# EAGLE design AS5040_forMotor (EAGLE 6.0)
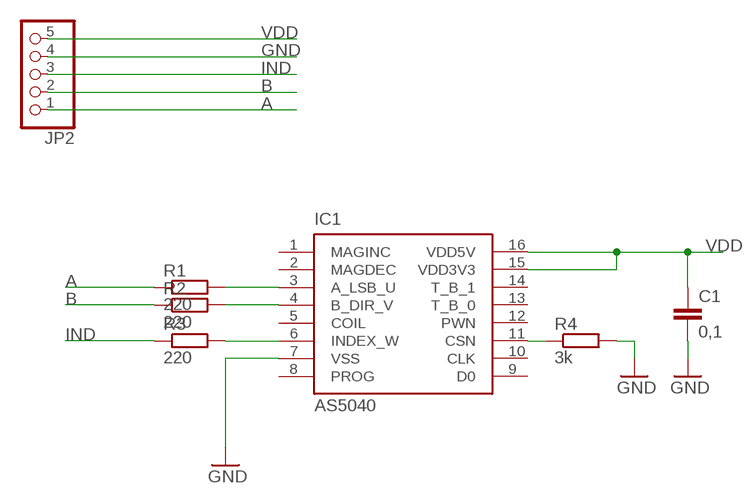
[diagram p0: schematic, sheet 1]

## Parts
C1  0,1  C-EUC0805  [C0805]
IC1  AS5040  [SSOP16]
JP2  PINHD-1X5  [1X05]
R1  220  R-EU_M0805  [M0805]
R2  220  R-EU_M0805  [M0805]
R3  220  R-EU_M0805  [M0805]
R4  3k  R-EU_M0805  [M0805]

## Nets
A: JP2.1 R1.1
B: JP2.2 R2.1
GND: C1.2 IC1.7(VSS) JP2.4 R4.2
IND: JP2.3 R3.1
N$1: IC1.6(INDEX_W) R3.2
N$2: IC1.3(A_LSB_U) R1.2
N$3: IC1.4(B_DIR_V) R2.2
N$4: IC1.11(CSN) R4.1
VDD: C1.1 IC1.15(VDD3V3) IC1.16(VDD5V) JP2.5
Unconnected: IC1.1(MAGINC) IC1.2(MAGDEC) IC1.5(COIL) IC1.8(PROG) IC1.9(D0) IC1.10(CLK) IC1.12(PWN) IC1.13(T_B_0) IC1.14(T_B_1)

## Library data of the parts
C1 = rcl:C-EU: CAPACITOR, European symbol
IC1 = austriamicrosystems:AS5040: 10-BIT PROGRAMMABLE MAGNETIC ROTARY ENCODER Source: www.austriamicrosystems.com .. AS5040DataSheetRev12.pdf; MPN: AS5040ASSU; OC_FARNELL: 1630800; OC_NEWARK: 59P4059
JP2 = pinhead:PINHD-1X5: PIN HEADER
R1-R4 = resistor:R-EU_: RESISTOR, European symbol

## Board
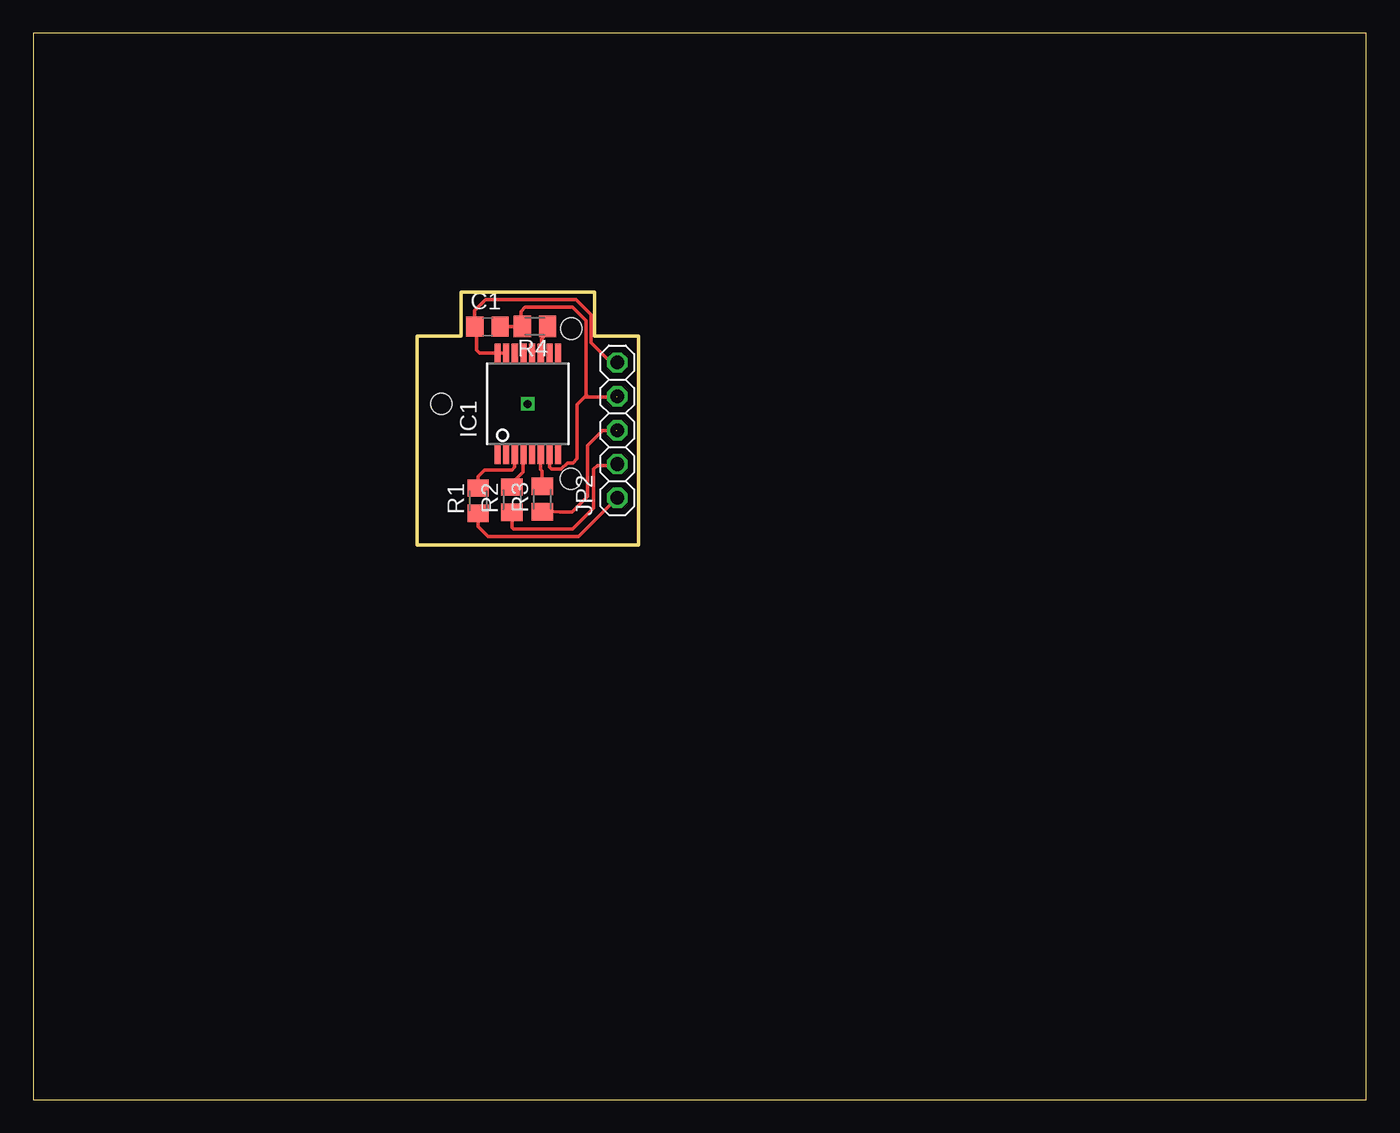
[diagram p1: board, top side]

Size 100 x 80 mm. Coordinates in mm from the lower left corner, seen from the top.
Outline: 0,0 100,0 100,80 0,80 0,0
Outline: 28.8,57.3 32.1,57.3 32.1,60.6 42.1,60.6 42.1,57.3 45.4,57.3 45.4,41.6 28.8,41.6 28.8,57.3
Copper layers (1*16): Top 0.035mm / dielectric 1.5mm / Bottom 0.035mm
Design rules: minimum track width 10mil, minimum drill 24mil, track to track 8mil, track to pad 8mil, pad to pad 8mil, via to via 8mil, smd to smd 8mil, copper to edge 40mil, drill to drill 8mil, minimum pad ring 10mil, minimum via ring 8mil, stop-mask expansion 4mil, vias tented up to drill 0mil, thermal gap 10mil
Holes 1.6 mm at 30.6,52.21 40.36,57.84 40.34,46.57

### Footprints (pad centres in the part's own frame; a part is rotated, then mirrored left to right if it is on the bottom)
C0805 = smd 1.3 x 1.5: 1 -0.95,0; 2 0.95,0
SSOP16 = smd 0.46 x 1.43: 1 -2.275,-3.795; 2 -1.625,-3.795; 3 -0.975,-3.795; 4 -0.325,-3.795; 5 0.325,-3.795; 6 0.975,-3.795; 7 1.625,-3.795; 8 2.275,-3.795; 9 2.275,3.795; 10 1.625,3.795; 11 0.975,3.795; 12 0.325,3.795; 13 -0.325,3.795; 14 -0.975,3.795; 15 -1.625,3.795; 16 -2.275,3.795
1X05 = drill 1.016 octagon: 1 -5.08,0; 2 -2.54,0; 3 0,0; 4 2.54,0; 5 5.08,0
M0805 = smd 1.3 x 1.6: 1 -0.95,0; 2 0.95,0

### Placement (x,y rotation side)
C1  34.07,57.99 0 top
IC1  37.1,52.2 0 top
JP2  43.81,50.22 90 top
R1  33.37,44.93 90 top
R2  35.9,45 90 top
R3  38.18,45.05 90 top
R4  37.63,58.02 180 top

### Tracks (layer width: path | path; a pad name or v marks a point on that pad's centre or on a via)
A
  Top 0.254: JP2.1 40.91,42.23 34.13,42.23 33.37,43 R1.1
B
  Top 0.254: JP2.2 43.69,47.56 42.31,47.56 42.05,47.3 42.05,44.38 40.47,42.8 36.02,42.8 35.91,42.91 R2.1
GND  (1 unrouted)
  Top 0.254: IC1.7 38.73,47.47 38.89,47.31 39.6,47.31 40.06,47.77 40.48,47.77 40.79,48.08 40.79,52.16 41.35,52.73 41.6,52.73 | 41.6,52.73 43.78,52.73 | C1.2 36.65,57.99 R4.2 36.59,58.11 36.59,59.13 36.9,59.44 40.47,59.44 41.45,58.46 41.45,52.88 41.6,52.73
IND  (1 unrouted)
  Top 0.254: R3.1 39.5,44.06 40.42,44.06 41.59,45.23 41.59,49.06 42.71,50.18 43.77,50.18
N$1
  Top 0.254: IC1.6 38.08,47.27 38.18,47.16 R3.2
N$2
  Top 0.254: IC1.3 36.1,48.38 36.1,47.45 35.9,47.25 33.87,47.25 33.37,46.75 R1.2
N$3
  Top 0.254: IC1.4 36.73,48.37 36.73,47.1 35.91,46.27 R2.2
N$4
  Top 0.254: R4.1 38.59,57.48 38.15,57.05 38.15,56.06 IC1.11
N$5  (via drill 0.6)
  other vias: 37.1,52.2
VDD
  Top 0.254: IC1.15 IC1.16 33.48,55.99 33.24,56.23 33.24,57.87 C1.1 33.11,58 33.11,59.21 33.92,60.02 40.7,60.02 41.85,58.88 41.85,56.78 43.34,55.3 JP2.5 43.67,55.3